# Altium schematic sheet LEMs.SchDoc
size A4; SheetNumber: 1; SheetTotal: 6
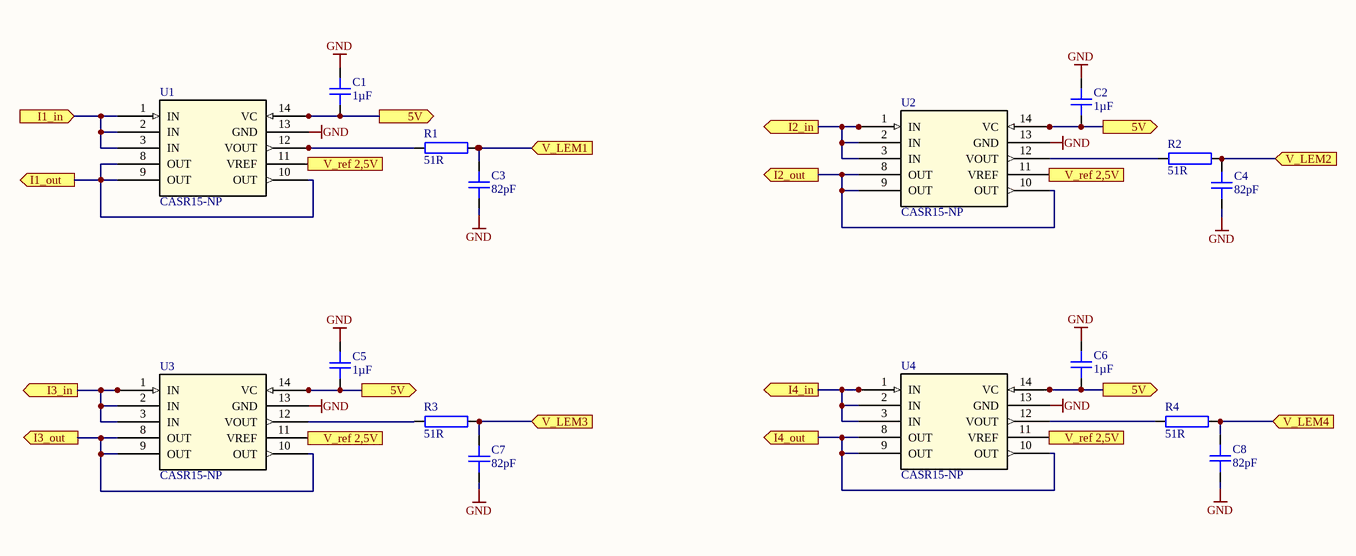
[diagram p0: LEMs.SchDoc]

## Parts
C1  1µF  [C0603]
C2  1µF  [C0603]
C3  82pF  [C0805]
C4  82pF  [C0805]
C5  1µF  [C0603]
C6  1µF  [C0603]
C7  82pF  [C0805]
C8  82pF  [C0805]
R1  51R  [R0805]
R2  51R  [R0805]
R3  51R  [R0805]
R4  51R  [R0805]
U1  CASR15-NP  [CASR X-NP]
U2  CASR15-NP  [CASR X-NP]
U3  CASR15-NP  [CASR X-NP]
U4  CASR15-NP  [CASR X-NP]

## Ports
5V (out), I1_in (in), I1_out (out), I2_in (out), I2_out (out), I3_in (out), I3_out (out), I4_in (out), I4_out (out), V_LEM1 (in), V_LEM2 (in), V_LEM3 (in), V_LEM4 (in), V_ref 2,5V (out)

## Nets
GND: C1.2 C2.2 C3.2 C4.2 C5.2 C6.2 C7.2 C8.1
5V: C1.1 C2.1 C5.1 C6.1 U1.14(VC) U2.14(VC) U3.14(VC) U4.14(VC) ; port 5V
I1_in: U1.1(IN) U1.2(IN) U1.3(IN) ; port I1_in
I1_out: U1.8(OUT) U1.9(OUT) U1.10(OUT) ; port I1_out
I2_in: U2.1(IN) U2.2(IN) U2.3(IN) ; port I2_in
I2_out: U2.8(OUT) U2.9(OUT) U2.10(OUT) ; port I2_out
I3_in: U3.1(IN) U3.2(IN) U3.3(IN) ; port I3_in
I3_out: U3.8(OUT) U3.9(OUT) U3.10(OUT) ; port I3_out
I4_in: U4.1(IN) U4.2(IN) U4.3(IN) ; port I4_in
I4_out: U4.8(OUT) U4.9(OUT) U4.10(OUT) ; port I4_out
V_LEM1: C3.1 R1.2 ; port V_LEM1
V_LEM2: C4.1 R2.2 ; port V_LEM2
V_LEM3: C7.1 R3.2 ; port V_LEM3
V_LEM4: C8.2 R4.2 ; port V_LEM4
V_ref 2,5V: U1.11(VREF) U2.11(VREF) U3.11(VREF) U4.11(VREF) ; port V_ref 2,5V
NetR1_1: R1.1 U1.12(VOUT)
NetR2_1: R2.1 U2.12(VOUT)
NetR3_1: R3.1 U3.12(VOUT)
NetR4_1: R4.1 U4.12(VOUT)

Not connected (* = marked no-connect by the designer): U1 13(GND); U2 13(GND); U3 13(GND); U4 13(GND)

## Notes on the sheet
- Labels drawn without touching a wire or pin: GND

## Library data of the parts
C1 C2 C5 C6 = GRT188R61H105KE13D: Multilayer Ceramic Capacitors MLCC - SMD/SMT 0603 50Vdc 1.0uF X5R 10%; Manufacturer: Murata; Capacitance: 1uF; Voltage Rating: 50V; Supplier 1: Mouser; Supplier Part Number 1: 81-GRT188R61H105KE3D; Manufacturer Part Number: GRT188R61H105KE13D; RoHS: Yes; Category: Ceramic Capacitors; Stock 1: 769371; Pricing 1: 1=0,26000, 10=0,10800, 50=0,10800, 100=0,09100, 500=0,06200, 1000=0,05500, 2000=0,05400, 4000=0,04700, 10000=0,04700 (USD); Mount: Surface Mount; Case/Package: 0603; Case Code (Metric): 1608; Case Code (Imperial): 0603; Min Operating Temperature: -55°C; Max Operating Temperature: 85°C; Packaging: Tape and Reel; Tolerance: 10%; Dielectric: X5R; Voltage Rating (DC): 50V; Length: 0.063inch; Width: 0.031inch; Thickness: 0.035inch; Ratings: AEC-Q200; RoHS Compliant: Yes; ComponentLink1URL: http://www.farnell.com/datasheets/2165959.pdf?src-supplier=Farnell; ComponentLink1Description: http://www.farnell.com/datasheets/2165959.pdf?src-supplier=Farnell; ComponentLink2URL: http://www.farnell.com/datasheets/2165959.pdf?src-supplier=Newark; ComponentLink2Description: http://www.farnell.com/datasheets/2165959.pdf?src-supplier=Newark; ComponentLink3URL: http://search.murata.co.jp/Ceramy/image/img/A01X/G101/ENG/GRT188R61H105KE13-01.pdf?src-supplier=Digi-Key; ComponentLink3Description: http://search.murata.co.jp/Ceramy/image/img/A01X/G101/ENG/GRT188R61H105KE13-01.pdf?src-supplier=Digi-Key; ComponentLink4URL: https://search.murata.co.jp/Ceramy/image/img/A01X/G101/ENG/GRT188R61H105KE13-01.pdf?src-supplier=Digi-Key; ComponentLink4Description: https://search.murata.co.jp/Ceramy/image/img/A01X/G101/ENG/GRT188R61H105KE13-01.pdf?src-supplier=Digi-Key
C3 C4 C7 C8 = C0805X820J5GACAUTO: Cap Ceramic 82pF 50V C0G 5% SMD 0805 125°C Paper T/R; Manufacturer: KEMET; Supplier 1: Mouser; Manufacturer Part Number: C0805X820J5GACAUTO; RoHS: Yes; Category: Ceramic Capacitors; Stock 1: 3758; Pricing 1: 1=0,38000, 10=0,27000, 50=0,27000, 100=0,16200, 1000=0,10200, 10000=0,09100 (USD); RoHS Compliant: Yes
R1-R4 = RK73B1JTTDD510J: Res Thick Film 0603 51 Ohm 5% 0.125W(1/8W) ±200ppm/C Pad SMD Automotive T/R; Manufacturer: KOA Speer; Voltage Rating: 50V; Power Rating: 100mW; Temperature Coefficient: 200ppm/°C; Supplier 1: Mouser; Manufacturer Part Number: RK73B1JTTDD510J; RoHS: Yes; Category: Chip SMD Resistors; Stock 1: 75390; Pricing 1: 1=0,10000, 10=0,01900, 50=0,01900, 100=0,00800, 1000=0,00400, 10000=0,00200 (USD); Case/Package: 0603; Case Code (Imperial): 0603; Case Code (Metric): 1608; Min Operating Temperature: -55°C; Max Operating Temperature: 155°C; Packaging: Tape and Reel; Tolerance: 5%; Resistance: 51R; Resistor Type: Thick Film; Termination: SMD/SMT; Series: RK73B; Construction: Rectangular; Length: 1.6mm; Depth: 0.8mm; Military Standard: Not; Lead Free: Lead Free; RoHS Compliant: Yes; ComponentLink1URL: http://www.mouser.com/ds/2/219/RK73B-919.pdf?src-supplier=Mouser; ComponentLink1Description: http://www.mouser.com/ds/2/219/RK73B-919.pdf?src-supplier=Mouser
U1-U4 = CASR15-NP: Sensor Current Flux 15A Ac/dc; Manufacturer: LEM; Frequency: 300kHz; Number of Channels: 1; Response Time: 0.3us; Max Supply Current: 20mA; Polarity: Bidirectional; Linearity: 1%; Accuracy: 0.8%; Operating Supply Voltage: 5.25V; Min Supply Voltage (DC): 4.75V; Sensitivity: 41.67mV/A; Overall Height: 16.5mm; Overall Depth: 13.4mm; Supplier 1: Digi-Key; Supplier Part Number 1: 398-1092-ND; Manufacturer Part Number: CASR15-NP; RoHS: Yes; Category: Current Sensors; Stock 1: 548; Pricing 1: 1=17,07000, 5=16,72600, 10=13,93800, 25=12,89280, 50=12,54420, 100=10,80200, 450=10,10504, 950=9,58238 (USD); Mount: Through Hole,PCB; Case/Package: Module; Min Operating Temperature: -40°C; Max Operating Temperature: 85°C; Package Quantity: 50; Packaging: Rail/Tube; Current Sensing: 15A; Series: CASR; Max Supply Voltage (DC): 5.25V; RoHS Compliant: Yes; REACH SVHC: No SVHC; ComponentLink1URL: https://datasheet.ciiva.com/2812/casrseries-2812487.pdf?src-supplier=Digi-Key; ComponentLink1Description: https://datasheet.ciiva.com/2812/casrseries-2812487.pdf?src-supplier=Digi-Key